# EAGLE design button-led-matrix-4x4 (EAGLE 7.7.0)
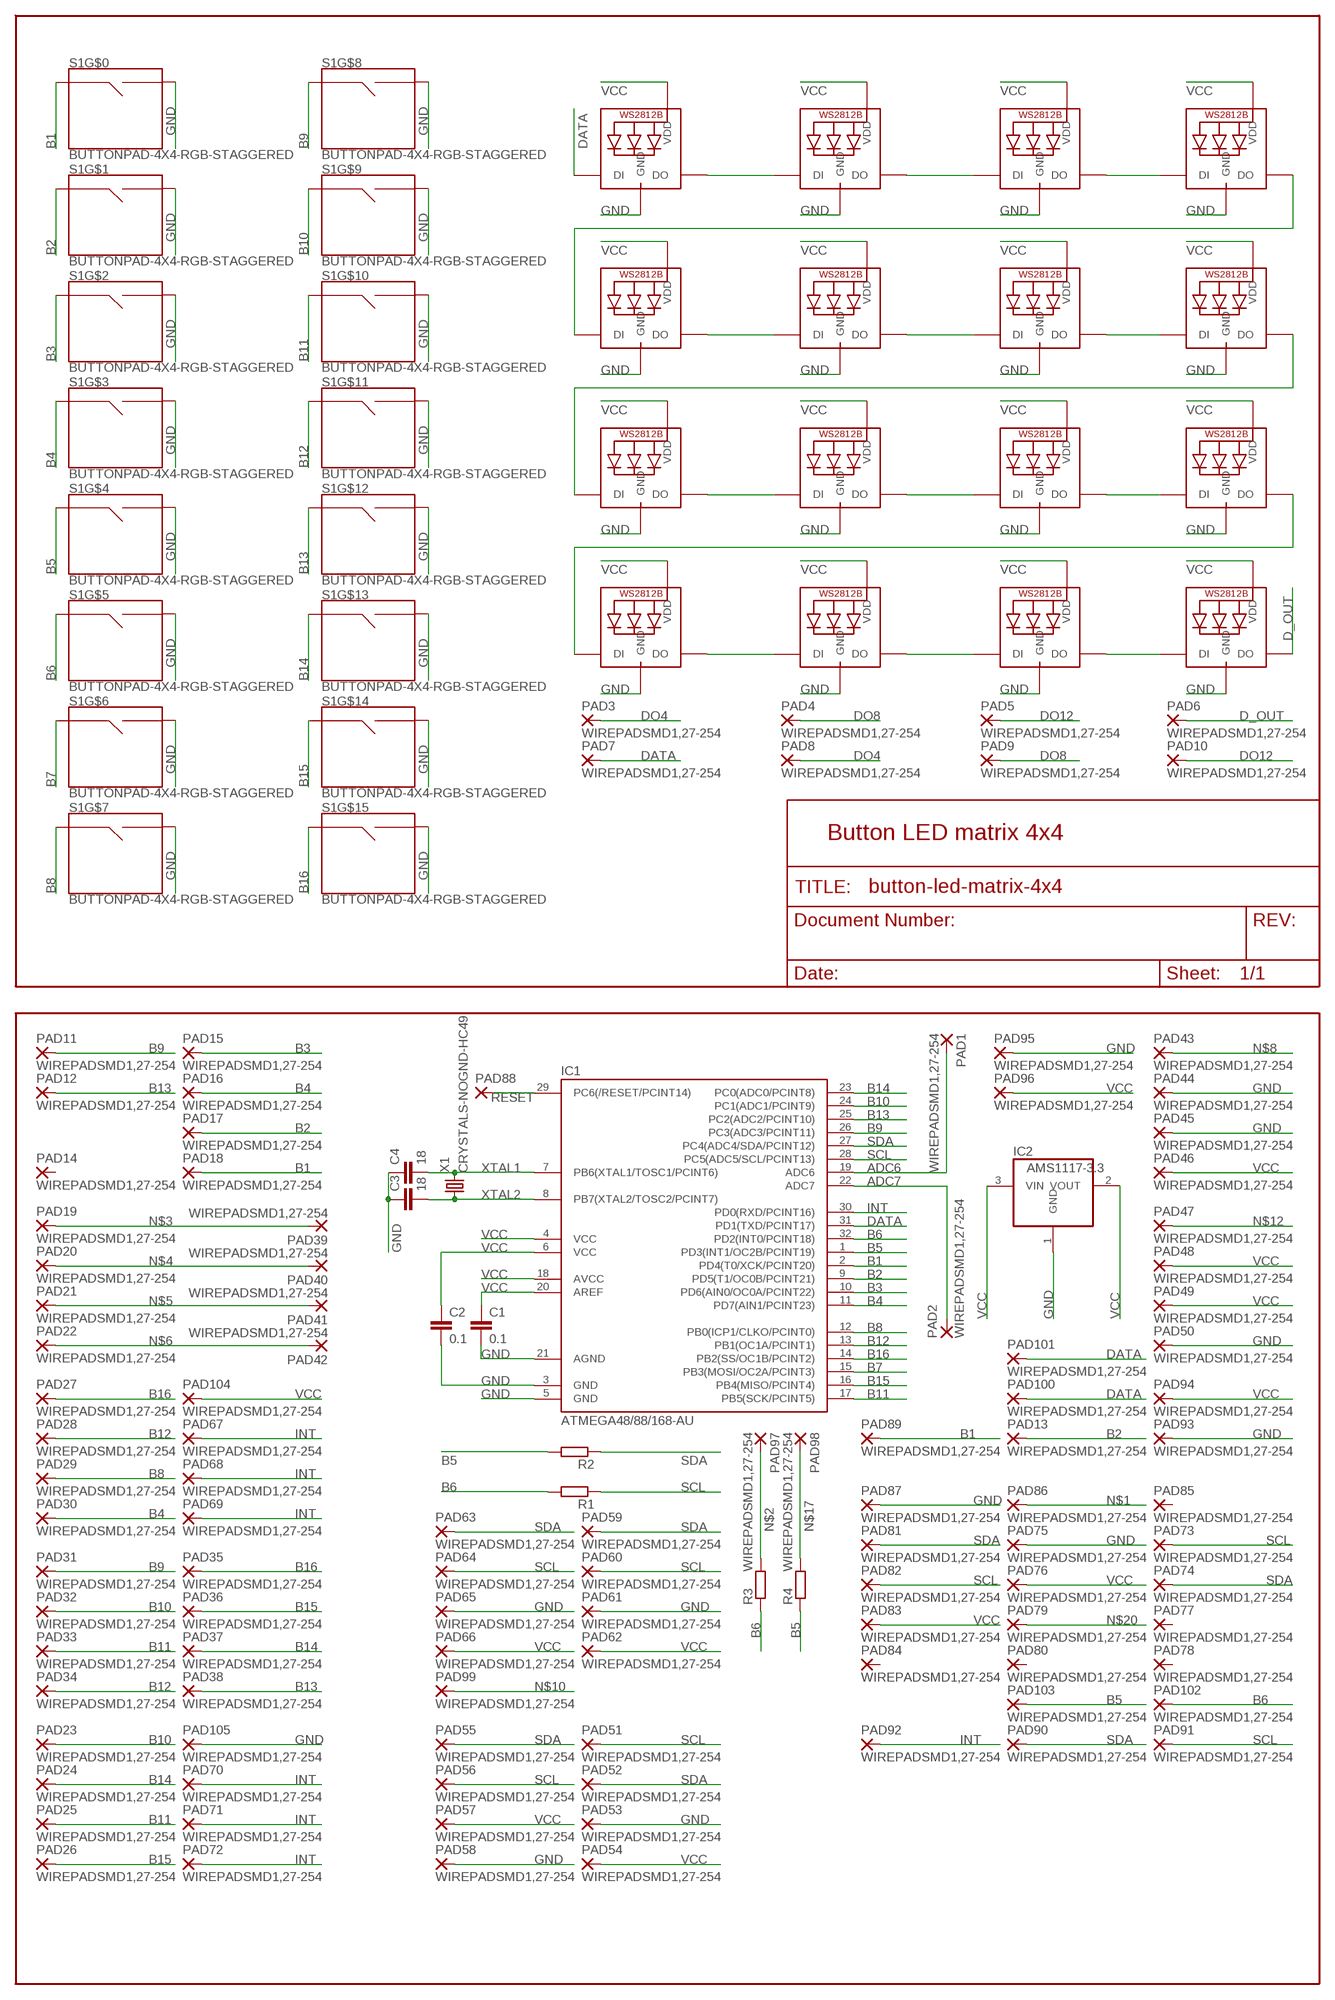
[diagram p0: schematic, sheet 1]

## Parts
C1  0.1  C-EUC0805  [C0805]
C2  0.1  C-EUC0805  [C0805]
C3  18  C-EUC0805  [C0805]
C4  18  C-EUC0805  [C0805]
IC1  ATMEGA48/88/168-AU  [TQFP32-08]
IC2  AMS1117-3.3  REG1117  [SOT223]
LED1  WS2812B_5050N  [WS2812B-NARROW]
LED2  WS2812B_5050N  [WS2812B-NARROW]
LED3  WS2812B_5050N  [WS2812B-NARROW]
LED4  WS2812B_5050N  [WS2812B-NARROW]
LED5  WS2812B_5050N  [WS2812B-NARROW]
LED6  WS2812B_5050N  [WS2812B-NARROW]
LED7  WS2812B_5050N  [WS2812B-NARROW]
LED8  WS2812B_5050N  [WS2812B-NARROW]
LED9  WS2812B_5050N  [WS2812B-NARROW]
LED10  WS2812B_5050N  [WS2812B-NARROW]
LED11  WS2812B_5050N  [WS2812B-NARROW]
LED12  WS2812B_5050N  [WS2812B-NARROW]
LED13  WS2812B_5050N  [WS2812B-NARROW]
LED14  WS2812B_5050N  [WS2812B-NARROW]
LED15  WS2812B_5050N  [WS2812B-NARROW]
LED16  WS2812B_5050N  [WS2812B-NARROW]
PAD1  WIREPADSMD1,27-254  [SMD1,27-2,54]
PAD2  WIREPADSMD1,27-254  [SMD1,27-2,54]
PAD3  WIREPADSMD1,27-254  [SMD1,27-2,54]
PAD4  WIREPADSMD1,27-254  [SMD1,27-2,54]
PAD5  WIREPADSMD1,27-254  [SMD1,27-2,54]
PAD6  WIREPADSMD1,27-254  [SMD1,27-2,54]
PAD7  WIREPADSMD1,27-254  [SMD1,27-2,54]
PAD8  WIREPADSMD1,27-254  [SMD1,27-2,54]
PAD9  WIREPADSMD1,27-254  [SMD1,27-2,54]
PAD10  WIREPADSMD1,27-254  [SMD1,27-2,54]
PAD11  WIREPADSMD1,27-254  [SMD1,27-2,54]
PAD12  WIREPADSMD1,27-254  [SMD1,27-2,54]
PAD13  WIREPADSMD1,27-254  [SMD1,27-2,54]
PAD14  WIREPADSMD1,27-254  [SMD1,27-2,54]
PAD15  WIREPADSMD1,27-254  [SMD1,27-2,54]
PAD16  WIREPADSMD1,27-254  [SMD1,27-2,54]
PAD17  WIREPADSMD1,27-254  [SMD1,27-2,54]
PAD18  WIREPADSMD1,27-254  [SMD1,27-2,54]
PAD19  WIREPADSMD1,27-254  [SMD1,27-2,54]
PAD20  WIREPADSMD1,27-254  [SMD1,27-2,54]
PAD21  WIREPADSMD1,27-254  [SMD1,27-2,54]
PAD22  WIREPADSMD1,27-254  [SMD1,27-2,54]
PAD23  WIREPADSMD1,27-254  [SMD1,27-2,54]
PAD24  WIREPADSMD1,27-254  [SMD1,27-2,54]
PAD25  WIREPADSMD1,27-254  [SMD1,27-2,54]
PAD26  WIREPADSMD1,27-254  [SMD1,27-2,54]
PAD27  WIREPADSMD1,27-254  [SMD1,27-2,54]
PAD28  WIREPADSMD1,27-254  [SMD1,27-2,54]
PAD29  WIREPADSMD1,27-254  [SMD1,27-2,54]
PAD30  WIREPADSMD1,27-254  [SMD1,27-2,54]
PAD31  WIREPADSMD1,27-254  [SMD1,27-2,54]
PAD32  WIREPADSMD1,27-254  [SMD1,27-2,54]
PAD33  WIREPADSMD1,27-254  [SMD1,27-2,54]
PAD34  WIREPADSMD1,27-254  [SMD1,27-2,54]
PAD35  WIREPADSMD1,27-254  [SMD1,27-2,54]
PAD36  WIREPADSMD1,27-254  [SMD1,27-2,54]
PAD37  WIREPADSMD1,27-254  [SMD1,27-2,54]
PAD38  WIREPADSMD1,27-254  [SMD1,27-2,54]
PAD39  WIREPADSMD1,27-254  [SMD1,27-2,54]
PAD40  WIREPADSMD1,27-254  [SMD1,27-2,54]
PAD41  WIREPADSMD1,27-254  [SMD1,27-2,54]
PAD42  WIREPADSMD1,27-254  [SMD1,27-2,54]
PAD43  WIREPADSMD1,27-254  [SMD1,27-2,54]
PAD44  WIREPADSMD1,27-254  [SMD1,27-2,54]
PAD45  WIREPADSMD1,27-254  [SMD1,27-2,54]
PAD46  WIREPADSMD1,27-254  [SMD1,27-2,54]
PAD47  WIREPADSMD1,27-254  [SMD1,27-2,54]
PAD48  WIREPADSMD1,27-254  [SMD1,27-2,54]
PAD49  WIREPADSMD1,27-254  [SMD1,27-2,54]
PAD50  WIREPADSMD1,27-254  [SMD1,27-2,54]
PAD51  WIREPADSMD1,27-254  [SMD1,27-2,54]
PAD52  WIREPADSMD1,27-254  [SMD1,27-2,54]
PAD53  WIREPADSMD1,27-254  [SMD1,27-2,54]
PAD54  WIREPADSMD1,27-254  [SMD1,27-2,54]
PAD55  WIREPADSMD1,27-254  [SMD1,27-2,54]
PAD56  WIREPADSMD1,27-254  [SMD1,27-2,54]
PAD57  WIREPADSMD1,27-254  [SMD1,27-2,54]
PAD58  WIREPADSMD1,27-254  [SMD1,27-2,54]
PAD59  WIREPADSMD1,27-254  [SMD1,27-2,54]
PAD60  WIREPADSMD1,27-254  [SMD1,27-2,54]
PAD61  WIREPADSMD1,27-254  [SMD1,27-2,54]
PAD62  WIREPADSMD1,27-254  [SMD1,27-2,54]
PAD63  WIREPADSMD1,27-254  [SMD1,27-2,54]
PAD64  WIREPADSMD1,27-254  [SMD1,27-2,54]
PAD65  WIREPADSMD1,27-254  [SMD1,27-2,54]
PAD66  WIREPADSMD1,27-254  [SMD1,27-2,54]
PAD67  WIREPADSMD1,27-254  [SMD1,27-2,54]
PAD68  WIREPADSMD1,27-254  [SMD1,27-2,54]
PAD69  WIREPADSMD1,27-254  [SMD1,27-2,54]
PAD70  WIREPADSMD1,27-254  [SMD1,27-2,54]
PAD71  WIREPADSMD1,27-254  [SMD1,27-2,54]
PAD72  WIREPADSMD1,27-254  [SMD1,27-2,54]
PAD73  WIREPADSMD1,27-254  [SMD1,27-2,54]
PAD74  WIREPADSMD1,27-254  [SMD1,27-2,54]
PAD75  WIREPADSMD1,27-254  [SMD1,27-2,54]
PAD76  WIREPADSMD1,27-254  [SMD1,27-2,54]
PAD77  WIREPADSMD1,27-254  [SMD1,27-2,54]
PAD78  WIREPADSMD1,27-254  [SMD1,27-2,54]
PAD79  WIREPADSMD1,27-254  [SMD1,27-2,54]
PAD80  WIREPADSMD1,27-254  [SMD1,27-2,54]
PAD81  WIREPADSMD1,27-254  [SMD1,27-2,54]
PAD82  WIREPADSMD1,27-254  [SMD1,27-2,54]
PAD83  WIREPADSMD1,27-254  [SMD1,27-2,54]
PAD84  WIREPADSMD1,27-254  [SMD1,27-2,54]
PAD85  WIREPADSMD1,27-254  [SMD1,27-2,54]
PAD86  WIREPADSMD1,27-254  [SMD1,27-2,54]
PAD87  WIREPADSMD1,27-254  [SMD1,27-2,54]
PAD88  1,6/0,8  [1,6/0,8]
PAD89  WIREPADSMD1,27-254  [SMD1,27-2,54]
PAD90  WIREPADSMD1,27-254  [SMD1,27-2,54]
PAD91  WIREPADSMD1,27-254  [SMD1,27-2,54]
PAD92  WIREPADSMD1,27-254  [SMD1,27-2,54]
PAD93  WIREPADSMD1,27-254  [SMD1,27-2,54]
PAD94  WIREPADSMD1,27-254  [SMD1,27-2,54]
PAD95  WIREPADSMD1,27-254  [SMD1,27-2,54]
PAD96  WIREPADSMD1,27-254  [SMD1,27-2,54]
PAD97  WIREPADSMD1,27-254  [SMD1,27-2,54]
PAD98  WIREPADSMD1,27-254  [SMD1,27-2,54]
PAD99  WIREPADSMD1,27-254  [SMD1,27-2,54]
PAD100  WIREPADSMD1,27-254  [SMD1,27-2,54]
PAD101  WIREPADSMD1,27-254  [SMD1,27-2,54]
PAD102  WIREPADSMD1,27-254  [SMD1,27-2,54]
PAD103  WIREPADSMD1,27-254  [SMD1,27-2,54]
PAD104  WIREPADSMD1,27-254  [SMD1,27-2,54]
PAD105  WIREPADSMD1,27-254  [SMD1,27-2,54]
R1  R-EU_R1206  [R1206]
R2  R-EU_R1206  [R1206]
R3  R-EU_R0805  [R0805]
R4  R-EU_R0805  [R0805]
S1  BUTTONPAD-4X4-RGB-STAGGERED  [BUTTONPAD-4X4-STAGGERED]
X1  CRYSTALS-NOGND-HC49  [HC49]

## Nets
ADC6: IC1.19(ADC6) PAD1.1(P)
ADC7: IC1.22(ADC7) PAD2.1(P)
B1: IC1.2(PD4(T0/XCK/PCINT20)) PAD18.1(P) PAD89.1(P) S1.SIG0(SIG1)
B2: IC1.9(PD5(T1/OC0B/PCINT21)) PAD13.1(P) PAD17.1(P) S1.SIG2(SIG1)
B3: IC1.10(PD6(AIN0/OC0A/PCINT22)) PAD15.1(P) S1.SIG4(SIG1)
B4: IC1.11(PD7(AIN1/PCINT23)) PAD16.1(P) PAD30.1(P) S1.SIG6(SIG1)
B5: IC1.1(PD3(INT1/OC2B/PCINT19)) PAD103.1(P) R2.2 R4.1 S1.SIG8(SIG1)
B6: IC1.32(PD2(INT0/PCINT18)) PAD102.1(P) R1.2 R3.1 S1.SIG10(SIG1)
B7: IC1.15(PB3(MOSI/OC2A/PCINT3)) S1.SIG12(SIG1)
B8: IC1.12(PB0(ICP1/CLKO/PCINT0)) PAD29.1(P) S1.SIG14(SIG1)
B9: IC1.26(PC3(ADC3/PCINT11)) PAD11.1(P) PAD31.1(P) S1.SIG16(SIG1)
B10: IC1.24(PC1(ADC1/PCINT9)) PAD23.1(P) PAD32.1(P) S1.SIG18(SIG1)
B11: IC1.17(PB5(SCK/PCINT5)) PAD25.1(P) PAD33.1(P) S1.SIG20(SIG1)
B12: IC1.13(PB1(OC1A/PCINT1)) PAD28.1(P) PAD34.1(P) S1.SIG22(SIG1)
B13: IC1.25(PC2(ADC2/PCINT10)) PAD12.1(P) PAD38.1(P) S1.SIG24(SIG1)
B14: IC1.23(PC0(ADC0/PCINT8)) PAD24.1(P) PAD37.1(P) S1.SIG26(SIG1)
B15: IC1.16(PB4(MISO/PCINT4)) PAD26.1(P) PAD36.1(P) S1.SIG28(SIG1)
B16: IC1.14(PB2(SS/OC1B/PCINT2)) PAD27.1(P) PAD35.1(P) S1.SIG30(SIG1)
D_OUT: LED16.2-DOUT(DO) PAD6.1(P)
DATA: IC1.31(PD1(TXD/PCINT17)) LED1.4-DIN(DI) PAD7.1(P) PAD100.1(P) PAD101.1(P)
DO1: LED1.2-DOUT(DO) LED2.4-DIN(DI)
DO2: LED2.2-DOUT(DO) LED3.4-DIN(DI)
DO3: LED3.2-DOUT(DO) LED4.4-DIN(DI)
DO4: LED4.2-DOUT(DO) LED5.4-DIN(DI) PAD3.1(P) PAD8.1(P)
DO6: LED6.2-DOUT(DO) LED7.4-DIN(DI)
DO7: LED7.2-DOUT(DO) LED8.4-DIN(DI)
DO8: LED8.2-DOUT(DO) LED9.4-DIN(DI) PAD4.1(P) PAD9.1(P)
DO9: LED9.2-DOUT(DO) LED10.4-DIN(DI)
DO10: LED10.2-DOUT(DO) LED11.4-DIN(DI)
DO11: LED11.2-DOUT(DO) LED12.4-DIN(DI)
DO12: LED12.2-DOUT(DO) LED13.4-DIN(DI) PAD5.1(P) PAD10.1(P)
DO13: LED13.2-DOUT(DO) LED14.4-DIN(DI)
DO14: LED14.2-DOUT(DO) LED15.4-DIN(DI)
DO15: LED15.2-DOUT(DO) LED16.4-DIN(DI)
FO5: LED5.2-DOUT(DO) LED6.4-DIN(DI)
GND: C1.2 C2.2 C3.1 C4.1 IC1.3(GND) IC1.5(GND) IC1.21(AGND) IC2.1(GND) LED1.3-GND(GND) LED2.3-GND(GND) LED3.3-GND(GND) LED4.3-GND(GND) LED5.3-GND(GND) LED6.3-GND(GND) LED7.3-GND(GND) LED8.3-GND(GND) LED9.3-GND(GND) LED10.3-GND(GND) LED11.3-GND(GND) LED12.3-GND(GND) LED13.3-GND(GND) LED14.3-GND(GND) LED15.3-GND(GND) LED16.3-GND(GND) PAD44.1(P) PAD45.1(P) PAD50.1(P) PAD53.1(P) PAD58.1(P) PAD61.1(P) PAD65.1(P) PAD75.1(P) PAD87.1(P) PAD93.1(P) PAD95.1(P) PAD105.1(P) S1.SIG1(SIG2) S1.SIG3(SIG2) S1.SIG5(SIG2) S1.SIG7(SIG2) S1.SIG9(SIG2) S1.SIG11(SIG2) S1.SIG13(SIG2) S1.SIG15(SIG2) S1.SIG17(SIG2) S1.SIG19(SIG2) S1.SIG21(SIG2) S1.SIG23(SIG2) S1.SIG25(SIG2) S1.SIG27(SIG2) S1.SIG29(SIG2) S1.SIG31(SIG2)
INT: IC1.30(PD0(RXD/PCINT16)) PAD67.1(P) PAD68.1(P) PAD69.1(P) PAD70.1(P) PAD71.1(P) PAD72.1(P) PAD92.1(P)
N$1: PAD86.1(P)
N$2: PAD97.1(P) R3.2
N$3: PAD19.1(P) PAD39.1(P)
N$4: PAD20.1(P) PAD40.1(P)
N$5: PAD21.1(P) PAD41.1(P)
N$6: PAD22.1(P) PAD42.1(P)
N$8: PAD43.1(P)
N$10: PAD99.1(P)
N$12: PAD47.1(P)
N$17: PAD98.1(P) R4.2
N$20: PAD79.1(P)
RESET: IC1.29(PC6(/RESET/PCINT14)) PAD88.1(P)
SCL: IC1.28(PC5(ADC5/SCL/PCINT13)) PAD51.1(P) PAD56.1(P) PAD60.1(P) PAD64.1(P) PAD73.1(P) PAD82.1(P) PAD91.1(P) R1.1
SDA: IC1.27(PC4(ADC4/SDA/PCINT12)) PAD52.1(P) PAD55.1(P) PAD59.1(P) PAD63.1(P) PAD74.1(P) PAD81.1(P) PAD90.1(P) R2.1
VCC: C1.1 C2.1 IC1.4(VCC) IC1.6(VCC) IC1.18(AVCC) IC1.20(AREF) IC2.2(VOUT) IC2.3(VIN) LED1.1-VDD(VDD) LED2.1-VDD(VDD) LED3.1-VDD(VDD) LED4.1-VDD(VDD) LED5.1-VDD(VDD) LED6.1-VDD(VDD) LED7.1-VDD(VDD) LED8.1-VDD(VDD) LED9.1-VDD(VDD) LED10.1-VDD(VDD) LED11.1-VDD(VDD) LED12.1-VDD(VDD) LED13.1-VDD(VDD) LED14.1-VDD(VDD) LED15.1-VDD(VDD) LED16.1-VDD(VDD) PAD46.1(P) PAD48.1(P) PAD49.1(P) PAD54.1(P) PAD57.1(P) PAD62.1(P) PAD66.1(P) PAD76.1(P) PAD83.1(P) PAD94.1(P) PAD96.1(P) PAD104.1(P)
XTAL1: C4.2 IC1.7(PB6(XTAL1/TOSC1/PCINT6)) X1.2
XTAL2: C3.2 IC1.8(PB7(XTAL2/TOSC2/PCINT7)) X1.1
Unconnected: PAD14.1(P) PAD77.1(P) PAD78.1(P) PAD80.1(P) PAD84.1(P) PAD85.1(P)

## Notes on the sheet
- Button LED matrix 4x4

## Library data of the parts
C1-C4 = rcl:C-EU: CAPACITOR, European symbol
IC1 = atmega8:ATMEGA48/88/168
IC2 = burr-brown:REG1117: 800mA and 1A Low Dropout (LDO) Positive Regulator 1.8V, 2.5V, 2.85V, 3.3V, 5V, and Adj; MPN: REG1117; OC_FARNELL: 1097566; OC_NEWARK: 14P6981
LED1-LED16 = adafruit:WS2812B
PAD1-PAD87 PAD89-PAD105 = wirepad:WIREPAD: Wire PAD connect wire on PCB
PAD88 = wirepad:1,6/0,8: THROUGH-HOLE PAD
R1-R4 = rcl:R-EU_: RESISTOR, European symbol
S1 = SparkFun-Switches:BUTTONPAD-4X4-RGB: 4x4 Button Pad w/ RGB LEDs Layout and schematic for 4x4 button pad with tri-color LEDs under each button. For use with the 4x Button Pad 2x2 - LED Compatible <https://www.sparkfun.com/products/7836> and 4x Button Pad 2x2 Top Bezel <https://www.sparkfun.com/products/8746>. Any RGB 5mm LED <https://www.sparkfun.com/categories/172> should be compatible. SparkFun Products SparkFun Simon Says - Through-Hole Soldering Kit <https://www.sparkfun.com/products/10547> (KIT-10547) Button Pad 2x2 - Breakout PCB <https://www.sparkfun.com/products/9277> (COM-09277); PROD_ID: COMP-08481; SF_SKU: COM-07836
X1 = IQD-Frequency-Products:CRYSTALS-NOGND: CRYSTALS CAN NOT GROUNDED

## Net classes
0 Default: width 0.254 mm
1 Power: width 0.305 mm
2 LEDPower: width 0.305 mm
3 ButtonSignal: width 0.254 mm

## Board
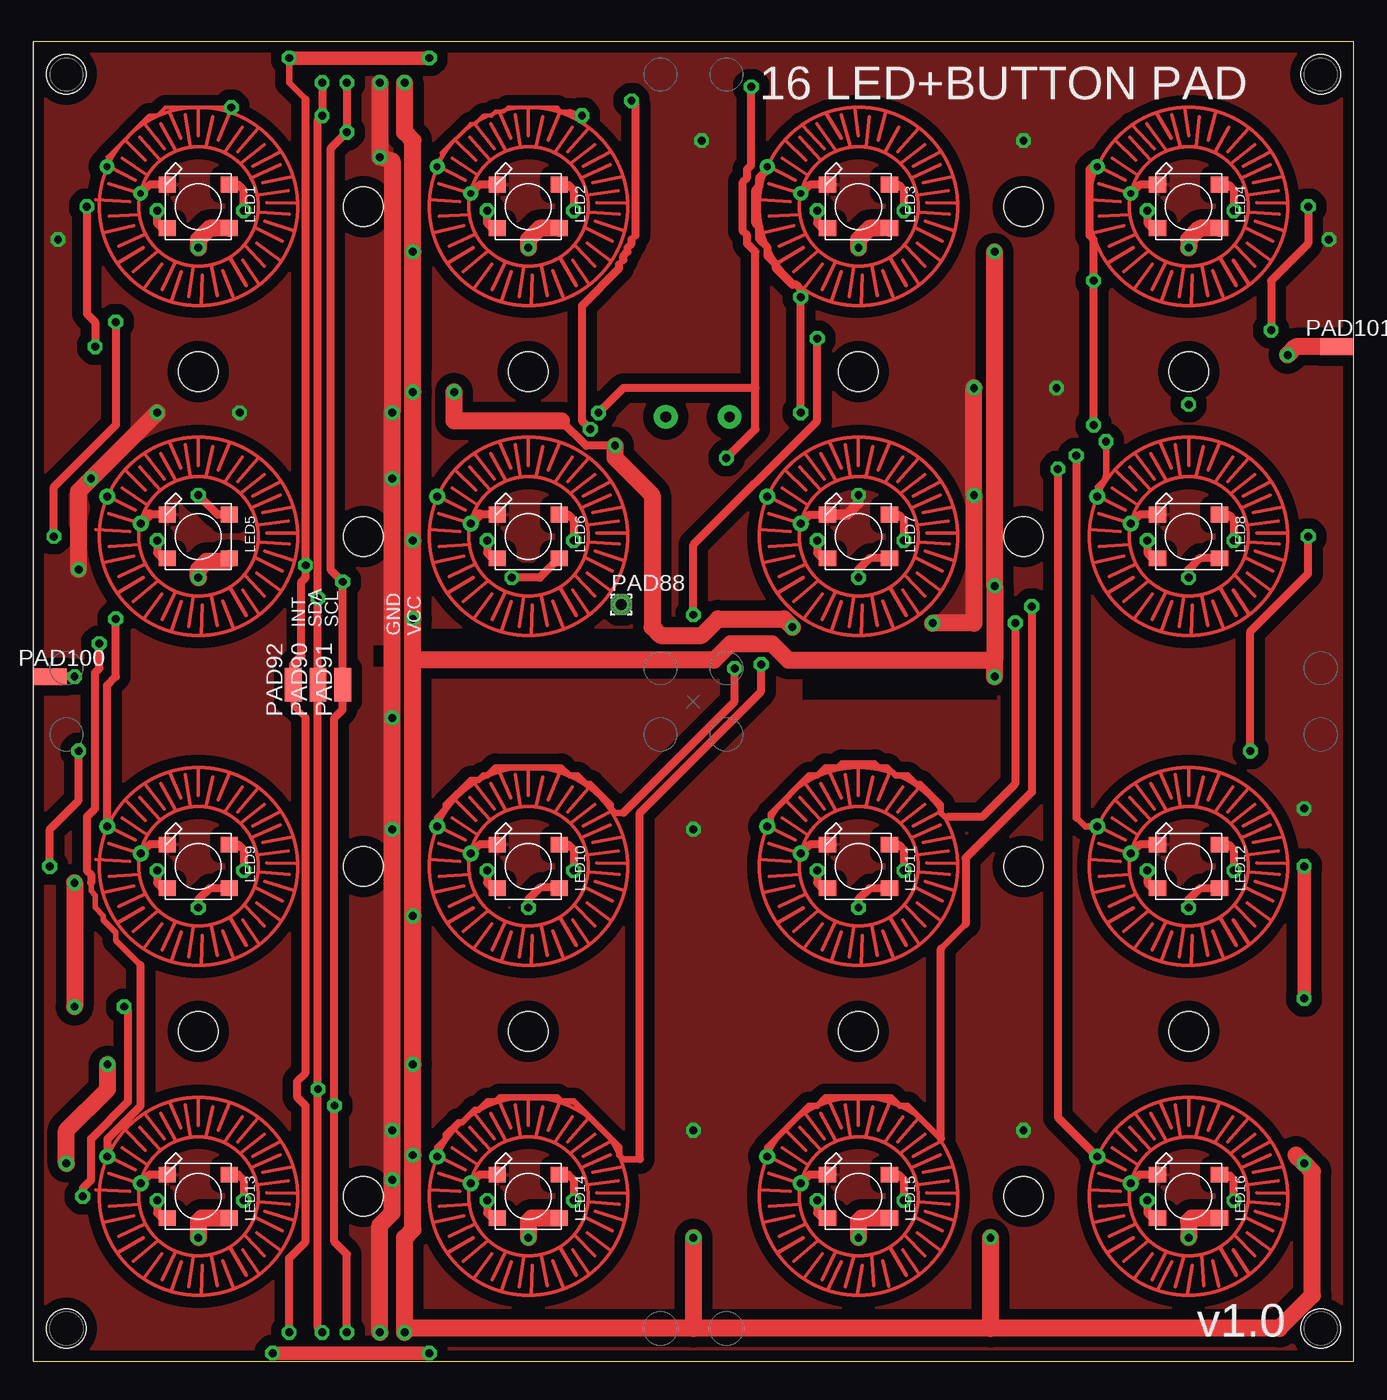
[diagram p1: board, top side]
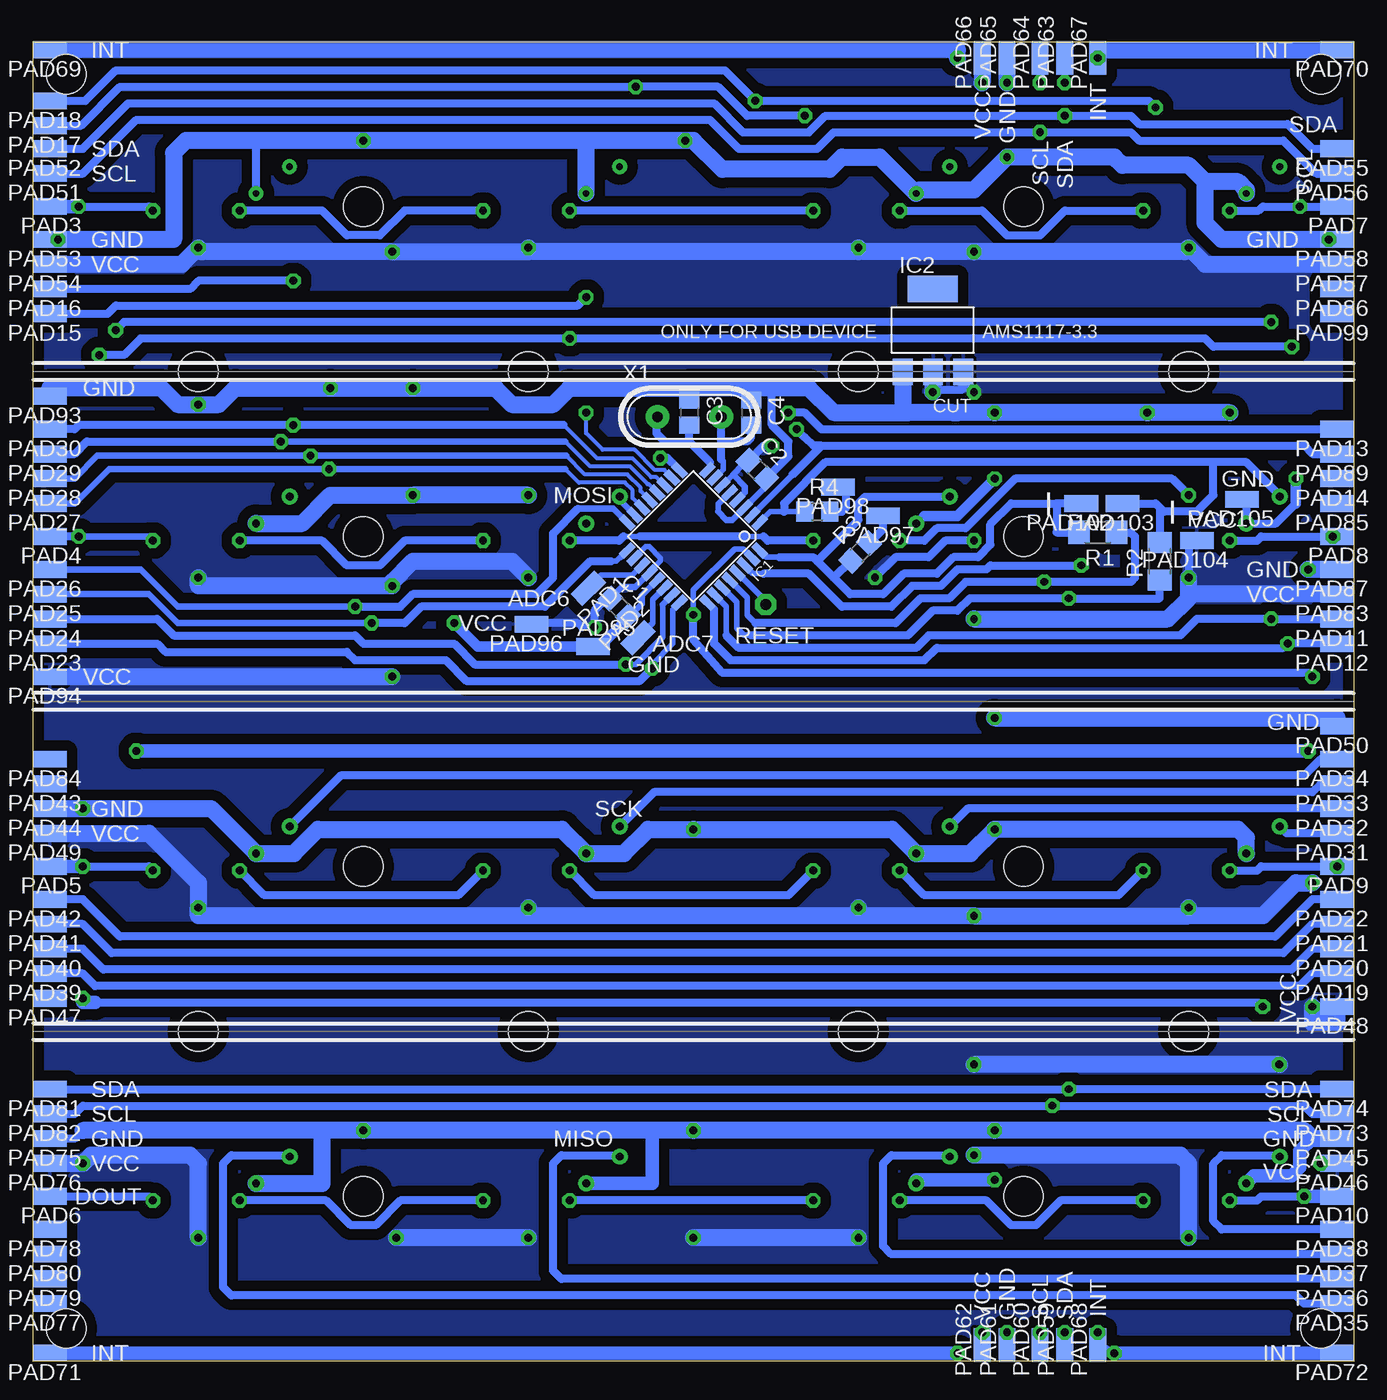
[diagram p2: board, bottom side, seen from below]

Size 100 x 100 mm. Coordinates in mm from the lower left corner, seen from the top.
Outline: 0,0 100,0 100,100 0,100 0,0
Copper layers (1*16): Top 0.035mm / dielectric 1.5mm / Bottom 0.035mm
Design rules "SparkFun": minimum track width 8mil, minimum drill 20mil, track to track 8mil, track to pad 8mil, pad to pad 8mil, via to via 8mil, smd to smd 8mil, copper to edge 10mil, drill to drill 8mil, minimum pad ring 12mil, minimum via ring 10mil, stop-mask expansion 4mil, vias tented up to drill 25mil, thermal gap 10mil

### Footprints (pad centres in the part's own frame; a part is rotated, then mirrored left to right if it is on the bottom)
C0805 = smd 1.3 x 1.5: 1 -0.95,0; 2 0.95,0
TQFP32-08 = smd 1.27 x 0.559: 1 -4.293,2.8; 2 -4.293,2; 3 -4.293,1.2; 4 -4.293,0.4; 5 -4.293,-0.4; 6 -4.293,-1.2; 7 -4.293,-2; 8 -4.293,-2.8; 17 4.293,-2.8; 18 4.293,-2; 19 4.293,-1.2; 20 4.293,-0.4; 21 4.293,0.4; 22 4.293,1.2; 23 4.293,2; 24 4.293,2.8 | smd 0.559 x 1.27: 9 -2.8,-4.293; 10 -2,-4.293; 11 -1.2,-4.293; 12 -0.4,-4.293; 13 0.4,-4.293; 14 1.2,-4.293; 15 2,-4.293; 16 2.8,-4.293; 25 2.8,4.293; 26 2,4.293; 27 1.2,4.293; 28 0.4,4.293; 29 -0.4,4.293; 30 -1.2,4.293; 31 -2,4.293; 32 -2.8,4.293
SOT223 = smd 1.499 x 2.007: 1 -2.261,-3.15; 2 0.025,-3.15; 3 2.311,-3.15 | smd 3.81 x 2.007: 4 0,3.15
WS2812B-NARROW = smd 1.3 x 1.2: 1-VDD 2.35,-1.65; 2-DOUT 2.35,1.65; 3-GND -2.35,1.65; 4-DIN -2.35,-1.65
SMD1,27-2,54 = smd 1.27 x 2.54: 1 0,0
1,6/0,8 = drill 0.813 pad 1.6 octagon: 1 0,0
R1206 = smd 1.6 x 1.803: 1 -1.422,0; 2 1.422,0
R0805 = smd 1.3 x 1.5: 1 -0.95,0; 2 0.95,0
BUTTONPAD-4X4-STAGGERED = drill 0.508: SIG0 5.588,90.513; SIG1 8.128,88.481; SIG2 30.588,90.513; SIG3 33.128,88.481; SIG4 55.588,90.513; SIG5 58.128,88.481; SIG6 80.588,90.513; SIG7 83.128,88.481 | drill 0.6: SIG8 5.588,65.513; SIG9 8.128,63.481; SIG10 30.588,65.513; SIG11 33.128,63.481; SIG12 55.588,65.513; SIG13 58.128,63.481; SIG14 80.588,65.513; SIG15 83.128,63.481; SIG16 5.588,40.513; SIG17 8.128,38.481; SIG18 30.588,40.513; SIG19 33.128,38.481; SIG20 55.588,40.513; SIG21 58.128,38.481; SIG22 80.588,40.513; SIG23 83.128,38.481; SIG24 5.588,15.513; SIG25 8.128,13.481; SIG26 30.588,15.513; SIG27 33.128,13.481; SIG28 55.588,15.513; SIG29 58.128,13.481; SIG30 80.588,15.513; SIG31 83.128,13.481 | hole 3: 12.5,25; 25,37.5; 37.5,25; 25,12.5; 62.5,25; 75,37.5; 87.5,25; 75,12.5; 12.5,75; 25,87.5; 37.5,75; 25,62.5; 62.5,75; 75,87.5; 87.5,75; 75,62.5; 2.484,97.516; 97.516,97.516; 97.516,2.484; 2.484,2.484
HC49 = drill 0.813 pad 1.8: 1 -2.413,0; 2 2.413,0

### Placement (x,y rotation side)
C1  55.62,57.13 315 bottom
C2  45.16,67.55 315 bottom
C3  50.31,71.88 270 bottom
C4  45.62,71.88 270 bottom
IC1  50,62.5 225 bottom
IC2  31.88,78.12 0 bottom
LED1  12.5,87.5 0 top
LED2  37.5,87.5 0 top
LED3  62.5,87.5 0 top
LED4  87.5,87.5 0 top
LED5  12.5,62.5 0 top
LED6  37.5,62.5 0 top
LED7  62.5,62.5 0 top
LED8  87.5,62.5 0 top
LED9  12.5,37.5 0 top
LED10  37.5,37.5 0 top
LED11  62.5,37.5 0 top
LED12  87.5,37.5 0 top
LED13  12.5,12.5 0 top
LED14  37.5,12.5 0 top
LED15  62.5,12.5 0 top
LED16  87.5,12.5 0 top
PAD1  57.96,58.58 135 bottom
PAD2  54.19,54.84 315 bottom
PAD3  98.75,87.5 90 bottom
PAD4  98.75,62.5 90 bottom
PAD5  98.75,37.5 90 bottom
PAD6  98.75,12.5 90 bottom
PAD7  1.25,87.5 90 bottom
PAD8  1.25,62.5 90 bottom
PAD9  1.25,37.5 90 bottom
PAD10  1.25,12.5 90 bottom
PAD11  1.25,56.25 90 bottom
PAD12  1.25,54.38 90 bottom
PAD13  1.25,70.62 90 bottom
PAD14  1.25,66.88 90 bottom
PAD15  98.75,79.38 90 bottom
PAD16  98.75,81.25 90 bottom
PAD17  98.75,93.62 90 bottom
PAD18  98.75,95.5 90 bottom
PAD19  1.25,29.38 90 bottom
PAD20  1.25,31.25 90 bottom
PAD21  1.25,33.12 90 bottom
PAD22  1.25,35 90 bottom
PAD23  98.75,54.38 90 bottom
PAD24  98.75,56.25 90 bottom
PAD25  98.75,58.12 90 bottom
PAD26  98.75,60 90 bottom
PAD27  98.75,65 90 bottom
PAD28  98.75,66.88 90 bottom
PAD29  98.75,68.75 90 bottom
PAD30  98.75,70.62 90 bottom
PAD31  1.25,40 90 bottom
PAD32  1.25,41.88 90 bottom
PAD33  1.25,43.75 90 bottom
PAD34  1.25,45.62 90 bottom
PAD35  1.25,4.38 90 bottom
PAD36  1.25,6.25 90 bottom
PAD37  1.25,8.12 90 bottom
PAD38  1.25,10 90 bottom
PAD39  98.75,29.38 90 bottom
PAD40  98.75,31.25 90 bottom
PAD41  98.75,33.12 90 bottom
PAD42  98.75,35 90 bottom
PAD43  98.75,43.75 90 bottom
PAD44  98.75,41.88 90 bottom
PAD45  1.25,16.88 90 bottom
PAD46  1.25,15 90 bottom
PAD47  98.75,27.5 90 bottom
PAD48  1.25,26.88 90 bottom
PAD49  98.75,40 90 bottom
PAD50  1.25,48.12 90 bottom
PAD51  98.75,90 90 bottom
PAD52  98.75,91.88 90 bottom
PAD53  98.75,85 90 bottom
PAD54  98.75,83.12 90 bottom
PAD55  1.25,91.88 90 bottom
PAD56  1.25,90 90 bottom
PAD57  1.25,83.12 90 bottom
PAD58  1.25,85 90 bottom
PAD59  21.88,1.25 0 bottom
PAD60  23.75,1.25 0 bottom
PAD61  26.25,1.25 0 bottom
PAD62  28.12,1.25 0 bottom
PAD63  21.88,98.75 0 bottom
PAD64  23.75,98.75 0 bottom
PAD65  26.25,98.75 0 bottom
PAD66  28.12,98.75 0 bottom
PAD67  19.38,98.75 0 bottom
PAD68  19.38,1.25 0 bottom
PAD69  98.75,99.38 90 bottom
PAD70  1.25,99.38 90 bottom
PAD71  98.75,0.62 90 bottom
PAD72  1.25,0.62 90 bottom
PAD73  1.25,18.75 90 bottom
PAD74  1.25,20.62 90 bottom
PAD75  98.75,16.88 90 bottom
PAD76  98.75,15 90 bottom
PAD77  98.75,4.38 90 bottom
PAD78  98.75,10 90 bottom
PAD79  98.75,6.25 90 bottom
PAD80  98.75,8.12 90 bottom
PAD81  98.75,20.62 90 bottom
PAD82  98.75,18.75 90 bottom
PAD83  1.25,58.12 90 bottom
PAD84  98.75,45.62 90 bottom
PAD85  1.25,65 90 bottom
PAD86  1.25,81.25 90 bottom
PAD87  1.25,60 90 bottom
PAD88  44.53,57.34 0 top
PAD89  1.25,68.75 90 bottom
PAD90  21.56,51.25 0 top
PAD91  23.44,51.25 0 top
PAD92  19.69,51.25 0 top
PAD93  98.75,73.12 90 bottom
PAD94  98.75,51.88 90 bottom
PAD95  57.59,54.15 270 bottom
PAD96  62.28,55.85 90 bottom
PAD97  35.62,64.06 90 bottom
PAD98  39.06,66.25 90 bottom
PAD99  1.25,79.38 90 bottom
PAD100  1.25,51.88 270 top
PAD101  98.75,76.88 270 top
PAD102  20.62,65 90 bottom
PAD103  17.5,65 90 bottom
PAD104  11.88,62.19 90 bottom
PAD105  8.44,65.31 90 bottom
R1  19.38,62.81 180 bottom
R2  14.69,60.62 90 bottom
R3  37.37,61.33 45 bottom
R4  40.62,64.38 0 bottom
S1  0,0 0 top
X1  50.31,71.56 0 bottom

### Tracks (layer width: path | path; a pad name or v marks a point on that pad's centre or on a via)
ADC6
  Bottom 0.406: IC1.19 54.63,59.56 56.97,59.56 PAD1.1
ADC7
  Bottom 0.406: IC1.22 53.09,57.72 53.09,55.94 PAD2.1
B1  (via drill 0.6)
  Top 0.305: v15,95 10,95 9.38,94.38 8.75,94.38 5.62,91.25 5.62,90.55 S1.SIG0
  Top 0.406: 44.38,83.12 44.69,83.44 | 45,84.06 45,84.38 | 45.31,85 45.62,85.31 | 45.62,95.19 v45.31,95.5
  Top 0.61: 44.38,83.12 44.38,82.81 41.56,80 41.56,71.25 v42.19,70.62 | 44.69,83.44 44.69,83.75 45,84.06 | 45,84.38 45.31,84.69 45.31,85 | 45.62,85.31 45.62,95.19
  Bottom 0.406: IC1.2 42.48,67.19
  Bottom 0.61: v15,95 15.5,95.5 v45.31,95.5 47.62,97.81 93.75,97.81 96.06,95.5 PAD18.1 | 42.48,67.19 40.3,69.38 | 40.3,69.38 40.94,69.39 41.56,70 v42.19,70.62 | 40.3,69.38 3.75,69.38 3.12,68.75 PAD89.1
B2  (via drill 0.6)
  Top 0.305: 40.62,94.69 40,94.69 39.69,95 35.94,95 35.62,94.69 35,94.69 34.69,94.38 34.06,94.38 33.44,93.75 33.12,93.75 30.94,91.56 30.94,91.25 30.59,90.9 S1.SIG2
  Top 0.406: 40.62,94.69 v41.56,94.38
  Top 0.61: 30.59,90.28 S1.SIG2 | v54.38,96.56 54.38,90.62 54.06,90.31 54.06,89.69 53.75,89.38 53.75,85.62 54.06,85.31 54.06,84.69 54.69,84.06 54.69,73.75 | v52.5,68.44 54.69,70.62 54.69,73.75 | 54.69,73.75 44.69,73.75 v42.81,71.88
  Bottom 0.305: IC1.9 51.6,68.06
  Bottom 0.61: PAD17.1 96.38,93.62 93.44,96.56 v54.38,96.56 48.12,96.56 45.94,94.38 v41.56,94.38 | 51.6,68.06 51.98,68.44 v52.5,68.44 | PAD13.1 40.31,70.62 41.56,71.88 v42.81,71.88
B3  (via drill 0.6)
  Top 0.61: S1.SIG4 55.59,90.28 55,89.69 55,89.06 54.69,88.75 54.69,86.25 55,85.94 55,85 55.62,84.38 55.62,83.75 56.25,83.12 56.25,82.81 57.5,81.56 57.81,81.56 58.12,81.25 v58.12,80.62 v58.12,71.88
  Bottom 0.305: IC1.10 52.2,67.53 52.93,67.53 54.46,69.06 56.88,69.06 58.12,70.31 v58.12,71.88
  Bottom 0.61: PAD15.1 94.38,79.38 93.75,80 58.75,80 v58.12,80.62
B4  (via drill 0.6)
  Top 0.61: v80.31,70.94 v80.31,81.88 80.31,85 80,85.31 80,90.31 80.2,90.51 S1.SIG6
  Bottom 0.305: IC1.11 52.8,67 53.2,67 54.6,68.4 57.3,68.4 59.84,70.94
  Bottom 0.61: 59.84,70.94 v80.31,70.94 96.56,70.94 96.88,70.62 PAD30.1 | v80.31,81.88 87.5,81.88 88.12,81.25 PAD16.1
B5
  Bottom 0.406: R4.1 43.12,64.38 44.16,64.38 IC1.1
  Bottom 0.61: S1.SIG8 5.59,65.59 8.12,68.12 10.62,68.12 | 10.62,68.12 40,68.12 43.12,65 43.12,64.38 | 10.62,68.12 10.62,65.62 11.88,64.38 14.38,64.38 14.69,64.69 | PAD103.1 15,65 14.69,64.69 | 14.69,64.69 R2.2
B6
  Bottom 0.406: IC1.32 44.48,60.94 43.49,60.94
  Bottom 0.61: S1.SIG10 36.99,65.51 37.5,65 37.5,63.75 40.62,60.62 | 43.49,60.94 40.94,60.94 40.62,60.62 | 39.38,59.38 38.12,58.12 35.62,58.12 34.06,59.69 31.56,59.69 30.31,60.94 28.44,60.94 27.5,61.88 27.5,63.44 25.94,65 22.5,65 | 39.38,59.38 40.62,60.62 | R3.1 38.1,60.65 39.38,59.38 | PAD102.1 22.5,65 | 22.5,65 22.5,62.81 R1.2
B7
  Bottom 0.406: IC1.15 55.59,65.26 S1.SIG12
B8  (via drill 0.6)
  Top 0.508: v81.25,69.69 81.25,67.14 arc-45 81.06,66.69 80.62,66.25 80.62,65.6 arc-45 S1.SIG14
  Bottom 0.305: IC1.12 53.4,66.47 53.47,66.47 54.8,67.8 57.81,67.8 59.7,69.69
  Bottom 0.508: 59.7,69.69 v81.25,69.69
  Bottom 0.61: PAD29.1 96.88,68.75 95.94,69.69 v81.25,69.69
B9  (via drill 0.6)
  Top 0.61: S1.SIG16 5.59,51.21 6.25,51.88 v6.25,56.25
  Bottom 0.406: IC1.26 47.5,57.17 47.5,55
  Bottom 0.61: PAD31.1 5.08,40 S1.SIG16 | 47.5,55 46.56,54.06 33.12,54.06 32.19,55 13.12,55 11.88,56.25 v6.25,56.25 PAD11.1
B10  (via drill 0.6)
  Top 0.5: S1.SIG18 30.59,41.21 31.25,41.88 31.25,42.19 33.12,44.06 33.75,44.06 34.06,44.38 34.38,44.38 35,45 40,45 40.62,44.38 41.25,44.38 41.88,43.75 42.19,43.75 43.75,42.19 43.75,41.88 44.06,41.56 44.69,41.56
  Top 0.61: 44.69,41.56 53.12,50 v53.12,52.5
  Bottom 0.406: IC1.24 51.56,56.98 51.56,54.38 53.12,52.81 v53.12,52.5
  Bottom 0.61: PAD32.1 29.23,41.88 S1.SIG18 | v53.12,52.5 54.06,51.56 67.19,51.56 68.75,53.12 75.62,53.12 76.25,53.75 90,53.75 90.62,54.38 PAD23.1
B11  (via drill 0.6)
  Top 0.5: 55.85,40.83 55.85,41.48 58.75,44.38 59.38,44.38 60,45 60.94,45 61.25,45.31 63.75,45.31 64.06,45 64.69,45 65.31,44.38 66.25,44.38 66.88,43.75 67.19,43.75 68.75,42.19 68.75,41.56 69.06,41.25 69.38,41.25
  Top 0.61: 55.85,40.83 S1.SIG20 | v74.38,55.94 74.38,43.75 71.88,41.25 69.38,41.25
  Bottom 0.406: 56.25,60.62 55.84,60.62 IC1.17
  Bottom 0.5: v74.38,55.94 89.06,55.94 91.25,58.12 PAD25.1
  Bottom 0.508: IC1.17 55.52,60.94
  Bottom 0.61: S1.SIG20 52.98,43.12 3.12,43.12 2.5,43.75 PAD33.1 | 56.25,60.62 57.81,60.62 61.25,57.19 70.62,57.19 71.88,55.94 v74.38,55.94
B12  (via drill 0.6)
  Top 0.508: 79,41.2 79.69,40.51 S1.SIG22
  Top 0.61: v79,68.61 79,41.2
  Bottom 0.305: IC1.13 54,65.93 54,66.2 55,67.2 58.21,67.2 59.62,68.61
  Bottom 0.5: v79,68.61 95.14,68.61 96.88,66.88 PAD28.1
  Bottom 0.508: 59.62,68.61 v79,68.61
  Bottom 0.61: S1.SIG22 76.73,44.38 3.75,44.38 2.5,45.62 PAD34.1
B13  (via drill 0.6)
  Top 0.406: 4.38,36.25 4.38,35.62 4.69,35.31 4.69,34.38 5.31,33.75 5.31,33.44 6.25,32.5 6.25,31.88 8.12,30
  Top 0.61: S1.SIG24 5.62,15.55 5.62,16.88 8.12,19.38 8.12,30 | 4.38,36.25 4.38,36.88 4.06,37.19 4.06,41.25 4.69,41.88 4.69,52.19 5,52.5 v5,54.38
  Bottom 0.406: IC1.25 48.44,56.98
  Bottom 0.61: PAD38.1 10,10 10.62,10.62 10.62,15 10,15.62 5.7,15.62 S1.SIG24 | PAD12.1 v5,54.38 5.31,54.06 31.56,54.06 32.5,53.12 47.19,53.12 48.44,54.38 48.44,56.98
B14  (via drill 0.6)
  Top 0.5: S1.SIG26 30.59,16.21 31.25,16.88 31.25,17.19 32.19,18.12 32.5,18.12 33.44,19.06 33.75,19.06 34.38,19.69 35,19.69 35.31,20 39.69,20 40,19.69 40.94,19.69 44.38,16.25 44.38,15.62 44.69,15.31 45.94,15.31
  Top 0.508: 30.38,15.51 S1.SIG26
  Top 0.61: 45.94,15.31 45.94,41.56 55.14,50.76 v55.14,52.81
  Bottom 0.406: 52.32,57.35 52.32,54.86 54.38,52.81 v55.14,52.81
  Bottom 0.508: IC1.23 52.32,57.35
  Bottom 0.61: S1.SIG26 30.7,15.62 35,15.62 35.62,15 35.62,8.75 35,8.12 PAD37.1 | PAD24.1 90.62,56.25 89.38,55 75.62,55 75,54.38 68.12,54.38 66.56,52.81 v55.14,52.81
B15  (via drill 0.6)
  Top 0.5: S1.SIG28 55.59,16.21 58.75,19.38 59.38,19.38 60,20 65,20 65.62,19.38 66.25,19.38 68.75,16.88 | 68.75,31.25 70.62,33.12
  Top 0.61: 68.75,16.88 68.75,31.25 | v75.62,57.19 75.62,43.12 70.62,38.12 70.62,33.12
  Bottom 0.5: PAD26.1 91.88,60 89.06,57.19 v75.62,57.19
  Bottom 0.508: IC1.16 56.06,64.6 58.75,64.6
  Bottom 0.61: S1.SIG28 55.7,15.62 60,15.62 60.62,15 60.62,6.88 60,6.25 PAD36.1 | 58.75,64.6 60.62,62.73 60.62,59.38 61.88,58.12 71.25,58.12 72.19,57.19 v75.62,57.19
B16  (via drill 0.6)
  Top 0.61: v77.6,67.61 77.6,18.5 S1.SIG30
  Bottom 0.305: IC1.14 54.6,65.4 54.6,66 55.2,66.6 58.62,66.6 58.66,66.56 59.71,67.61
  Bottom 0.5: v77.6,67.61 94.26,67.61 96.88,65 PAD27.1
  Bottom 0.508: 59.71,67.61 v77.6,67.61
  Bottom 0.61: S1.SIG30 80.7,15.62 85,15.62 85.62,15 85.62,5.62 85,5 4.38,5 3.75,4.38 PAD35.1
D_OUT  (via drill 0.6)
  Top 0.61: v90.94,12.19 90.94,13.75 90.62,14.06 89.94,14.06 LED16.2-DOUT
  Bottom 0.61: PAD6.1 91.25,12.5 v90.94,12.19
DATA  (via drill 0.6)
  Top 0.61: LED1.4-DIN 10.06,85.94 9.69,85.94 9.38,86.25 v9.38,87.19 | v50,56.56 50,61.88 59.38,71.25 v59.38,77.5 | v4.06,87.5 4.06,79.38 4.69,78.75 v4.69,76.88 | v3.12,51.88 PAD100.1
  Top 1.27: PAD101.1 95.62,76.88 v95,76.25
  Bottom 0.406: IC1.31 46.23,61.56 46.88,61.56 50,58.44 v50,56.56
  Bottom 0.61: v9.38,87.19 7.19,87.19 6.88,87.5 v4.06,87.5 PAD7.1 | v4.69,76.88 10.62,76.88 11.25,77.5 v59.38,77.5 91.88,77.5 93.12,76.25 v95,76.25 | v50,56.56 50,54.69 47.81,52.19 3.44,52.19 v3.12,51.88
DO1  (via drill 0.6)
  Top 0.61: LED2.4-DIN 35.06,85.94 34.69,85.94 34.38,86.25 v34.38,87.19 | v15.94,87.19 15.94,88.75 15.54,89.15 LED1.2-DOUT
  Bottom 0.61: v34.38,87.19 28.12,87.19 26.25,85.31 23.75,85.31 21.88,87.19 v15.94,87.19
DO2  (via drill 0.6)
  Top 0.61: LED2.2-DOUT 40.54,89.15 40.94,88.75 v40.94,87.19 | v59.38,87.19 59.38,86.25 59.69,85.94 60.06,85.94 LED3.4-DIN
  Bottom 0.61: v40.94,87.19 v59.38,87.19
DO3  (via drill 0.6)
  Top 0.61: LED3.2-DOUT 65.54,89.15 65.94,88.75 v65.94,87.19 | v84.38,87.19 84.38,86.25 84.69,85.94 85.06,85.94 LED4.4-DIN
  Bottom 0.61: v65.94,87.19 71.88,87.19 73.75,85.31 76.25,85.31 78.12,87.19 v84.38,87.19
DO4  (via drill 0.6)
  Top 0.61: LED4.2-DOUT 90.54,89.15 90.94,88.75 v90.94,87.19 | v9.38,62.19 9.38,61.25 9.69,60.94 10.06,60.94 LED5.4-DIN | v96.56,87.5 96.56,84.69 93.75,81.88 v93.75,78.12 | v1.56,62.5 1.56,66.25 6.25,70.94 v6.25,78.75
  Bottom 0.61: PAD3.1 98.12,87.5 91.25,87.5 v90.94,87.19 | v9.38,62.19 7.31,62.19 7,62.5 1.88,62.5 | v1.56,62.5 PAD8.1 | v6.25,78.75 93.12,78.75 v93.75,78.12
  Bottom 1.016: v96.56,87.5 98.12,87.5 | v1.56,62.5 1.88,62.5
DO6  (via drill 0.6)
  Top 0.61: LED6.2-DOUT 40.54,64.15 40.94,63.75 v40.94,62.19 | v59.38,62.19 59.38,61.25 59.69,60.94 60.06,60.94 LED7.4-DIN
  Bottom 0.406: 44.69,62.5 45.94,62.5 | 54.06,62.5 55.31,62.5
  Bottom 0.61: v40.94,62.19 44.38,62.19 44.69,62.5 | 45.94,62.5 54.06,62.5 | 55.31,62.5 55.62,62.19 v59.38,62.19
DO7  (via drill 0.6)
  Top 0.61: LED7.2-DOUT 65.54,64.15 65.94,63.75 v65.94,62.19 | v84.38,62.19 84.38,61.25 84.69,60.94 85.06,60.94 LED8.4-DIN
  Bottom 0.61: v65.94,62.19 71.88,62.19 73.75,60.31 76.25,60.31 78.12,62.19 v84.38,62.19
DO8  (via drill 0.6)
  Top 0.61: LED8.2-DOUT 90.54,64.15 90.94,63.75 v90.94,62.19 | v9.38,37.19 9.38,36.25 9.69,35.94 10.06,35.94 LED9.4-DIN | v92.19,46.25 92.19,55.31 96.56,59.69 v96.56,62.5 | PAD9.1 1.25,40.31 3.44,42.5 v3.44,46.25
  Bottom 0.5: PAD4.1 91.25,62.5 v90.94,62.19
  Bottom 0.61: v9.38,37.19 7.31,37.19 7,37.5 PAD9.1 | v96.56,62.5 PAD4.1
  Bottom 1.016: v92.19,46.25 v3.44,46.25
  other vias: 1.25,37.5
DO9  (via drill 0.6)
  Top 0.61: LED9.2-DOUT 15.54,39.15 15.94,38.75 v15.94,37.19 | v34.38,37.19 34.38,36.25 34.69,35.94 35.06,35.94 LED10.4-DIN
  Bottom 0.61: v15.94,37.19 17.81,35.31 32.5,35.31 v34.38,37.19
DO10  (via drill 0.6)
  Top 0.61: LED10.2-DOUT 40.54,39.15 40.94,38.75 v40.94,37.19 | v59.38,37.19 59.38,36.25 59.69,35.94 60.06,35.94 LED11.4-DIN
  Bottom 0.61: v40.94,37.19 42.81,35.31 57.5,35.31 v59.38,37.19
DO11  (via drill 0.6)
  Top 0.61: LED11.2-DOUT 65.54,39.15 65.94,38.75 v65.94,37.19 | v84.38,37.19 84.38,36.25 84.69,35.94 85.06,35.94 LED12.4-DIN
  Bottom 0.61: v65.94,37.19 67.81,35.31 82.5,35.31 v84.38,37.19
DO12  (via drill 0.6)
  Top 0.61: LED12.2-DOUT 90.54,39.15 90.94,38.75 v90.94,37.19 | v9.38,12.19 9.38,11.25 9.69,10.94 10.06,10.94 LED13.4-DIN | v3.75,12.5 3.75,13.12 4.38,13.75 4.38,16.88 7.19,19.69 7.19,26.56 v6.88,26.88
  Top 1.016: v96.25,27.5 v96.25,37.5
  Bottom 0.61: PAD5.1 98.12,37.5 91.25,37.5 v90.94,37.19 | v9.38,12.19 7.31,12.19 7,12.5 1.88,12.5 PAD10.1 | 95.31,27.19 7.19,27.19 v6.88,26.88
  Bottom 1.016: 95.31,27.19 96.25,27.19 v96.25,27.5 | v96.25,37.5 98.12,37.5 | v3.75,12.5 1.88,12.5
DO13  (via drill 0.6)
  Top 0.61: LED13.2-DOUT 15.54,14.15 15.94,13.75 v15.94,12.19 | v34.38,12.19 34.38,11.25 34.69,10.94 35.06,10.94 LED14.4-DIN
  Bottom 0.61: v15.94,12.19 22.19,12.19 24.06,10.31 25.94,10.31 27.81,12.19 v34.38,12.19
DO14  (via drill 0.6)
  Top 0.61: LED14.2-DOUT 40.54,14.15 40.94,13.75 v40.94,12.19 | v59.38,12.19 59.38,11.25 59.69,10.94 60.06,10.94 LED15.4-DIN
  Bottom 0.61: v40.94,12.19 v59.38,12.19
DO15  (via drill 0.6)
  Top 0.61: LED15.2-DOUT 65.54,14.15 65.94,13.75 v65.94,12.19 | v84.38,12.19 84.38,11.25 84.69,10.94 85.06,10.94 LED16.4-DIN
  Bottom 0.61: v65.94,12.19 72.19,12.19 74.06,10.31 75.94,10.31 77.81,12.19 v84.38,12.19
FO5  (via drill 0.6)
  Top 0.61: v34.38,62.19 34.38,61.25 34.69,60.94 35.06,60.94 LED6.4-DIN | LED5.2-DOUT 13.97,64.15 v12.5,65.62
  Bottom 0.61: v12.5,65.62 13.75,66.88 25.62,66.88 29.38,63.12 31.56,63.12 32.5,62.19 v34.38,62.19
GND  (via drill 0.6)
  Top 0.61: LED2.3-GND 33.8,89.15 S1.SIG3 | LED3.3-GND 58.8,89.15 S1.SIG5 | LED4.3-GND 83.8,89.15 S1.SIG7 | S1.SIG15 83.8,64.15 LED8.3-GND | S1.SIG13 58.8,64.15 LED7.3-GND | LED6.3-GND 33.8,64.15 | LED5.3-GND 8.8,64.15 | LED9.3-GND 8.8,39.15 S1.SIG17 | LED10.3-GND 33.8,39.15 S1.SIG19 | LED11.3-GND 58.8,39.15 S1.SIG21 | LED12.3-GND 83.8,39.15 S1.SIG23 | LED16.3-GND 83.8,14.15 S1.SIG31 | LED15.3-GND 58.8,14.15 S1.SIG29 | LED14.3-GND 33.8,14.15 S1.SIG27 | LED1.3-GND 8.8,89.15 S1.SIG1 | LED13.3-GND 8.8,14.15 S1.SIG25
  Top 0.813: LED7.3-GND 61.65,64.15 62.5,65 v62.5,65.62 | S1.SIG9 8.8,64.15 | 33.8,64.15 S1.SIG11
  Top 1.27: v26.25,96.88 v26.25,91.25 27.19,90.94 v27.19,71.88 v27.19,48.75 v27.19,40.31 v27.19,17.5 v27.19,13.75 27.19,11.25 26.25,10.31 v26.25,2.19 | v71.25,73.75 v71.25,65.62 71.25,55.94 v68.12,55.94 | v9.38,71.88 v4.38,66.88 3.44,65.94 v3.44,60
  Bottom 0.406: 44.48,66.32 IC1.3 47.05,63.75 | IC1.5 48.07,65 48.12,65 48.12,64.38 | IC1.21 53.9,58.03
  Bottom 0.508: 44.48,66.32 C2.2 | 47.05,63.75 47.5,63.75 48.12,64.38 | 53.9,58.03 53.9,57.39 54.82,56.46 C1.2
  Bottom 0.61: C1.2 55.1,56.46 | 99.38,85 PAD53.1 | S1.SIG7 83.13,92.18 83.12,92.5 | 58.13,92.5 58.44,92.5 | PAD61.1 v26.25,2.19 | 96.25,17.5 96.88,16.88 PAD75.1 | 45.62,73.75 C4.1 | C2.2 42.81,68.55 42.81,69.69 44.06,70.94 44.06,73.75 | 4.38,65 5.89,63.48 S1.SIG9 8.13,65.31 PAD105.1 | S1.SIG11 32.55,64.06 32.5,64.06 | 30,71.88 30.31,71.88
  Bottom 0.813: 55.1,56.46 55.1,56.15 57.1,54.15 PAD95.1 | 4.38,65 v4.38,66.88 | PAD95.1 57.68,54.06 | v68.12,55.94 66.34,54.15 PAD95.1 | v27.19,66.88 30,64.06 32.5,64.06
  Bottom 1.016: S1.SIG29 53.12,13.48 53.12,17.5 | v27.19,13.75 33.13,13.75 S1.SIG27 | S1.SIG25 7.55,14.06 4.69,14.06 4.06,14.69 4.06,15.94 3.12,16.88
  Bottom 1.27: 50.31,73.75 45.62,73.75 44.06,73.75 41.25,73.75 39.39,71.89 35,71.88 33.75,71.88 | 50.31,73.75 C3.1 | PAD53.1 v98.12,85 89.38,85 89.38,91.56 88.44,92.5 83.12,92.5 v75,92.5 58.44,92.5 v50.62,92.5 50,92.5 47.81,90.31 39.69,90.31 38.75,91.25 35.9,91.25 S1.SIG3 32.86,88.75 28.75,88.75 v26.25,91.25 18.12,91.25 17.5,90.62 12.5,90.62 11.25,89.38 | PAD58.1 v1.88,85 10,85 11.25,86.25 11.25,89.38 | S1.SIG5 58.13,92.5 | PAD65.1 v26.25,96.88 | PAD45.1 3.12,16.88 3.75,17.5 v27.19,17.5 v50,17.5 53.12,17.5 v75,17.5 78.12,17.5 | 78.12,17.5 96.25,17.5 | S1.SIG17 8.13,39.69 8.75,40.31 v27.19,40.31 29.02,38.48 S1.SIG19 34.96,40.31 v50,40.31 53.44,40.31 55.27,38.48 S1.SIG21 59.96,40.31 78.44,40.31 80.27,38.48 S1.SIG23 86.52,41.88 v96.25,41.88 PAD44.1 | 50.31,73.75 59.38,73.75 60.62,72.5 63.75,72.5 65,73.75 v71.25,73.75 v77.5,73.75 84.69,73.75 85.94,72.5 89.06,72.5 90.31,73.75 98.75,73.75 PAD93.1 | IC2.1 34.14,72.11 33.75,71.88 | v62.5,65.62 v71.25,65.62 77.5,65.62 79.64,63.48 S1.SIG15 | PAD87.1 v3.44,60 | v9.38,71.88 v15.62,71.88 v27.19,71.88 30,71.88 | 30.31,71.88 33.75,71.88 | S1.SIG1 8.13,88.75 8.75,89.38 11.25,89.38 | S1.SIG31 78.12,13.48 78.12,17.5 | v27.19,48.75 1.25,48.75 PAD50.1
  pour Top (isolate 0.813): 29.38,100 29.38,54.38 0,54.38 0,100
  pour Top (isolate 0.813): 0,50 0,54.38 25.62,54.38 25.62,52.5 46.88,52.5 46.88,53.12 58.12,53.12 58.12,50
  pour Top (isolate 0.813): 0,0 100,0 100,50 0,50
  pour Top (isolate 0.813): 73.12,75 100,75 100,50 73.12,50
  pour Top (isolate 0.813): 29.38,100 100,100 100,75 29.38,75
  pour Top (isolate 0.813): 28.75,55.62 71.25,55.62 71.25,75 29.38,75
INT  (via drill 0.6)
  Top 0.406: 20.62,48.75 19.69,49.69 PAD92.1
  Top 0.5: 20.62,95.62 19.38,96.88 PAD67.1
  Top 0.61: v19.38,2.19 19.38,7.81 20.62,9.06 20.62,19.38 20,20 20,21.25 20.62,21.88 20.62,48.75 | 20.62,95.62 v20.62,60.31 20.62,59.38 20.31,59.06 20.31,53.44 19.69,52.81 PAD92.1
  Top 1.016: PAD67.1 v30,98.75 | v30,0.62 v18.12,0.62
  Bottom 0.406: 44.69,59.69 45.49,59.69 IC1.30
  Bottom 0.61: v19.38,2.19 PAD68.1 v18.12,0.62 | 44.69,59.69 41.25,59.69 38.75,57.19 35,57.19 33.44,58.75 31.25,58.75 30,60 27.81,60 27.5,60.31 v20.62,60.31
  Bottom 1.016: PAD72.1 v18.12,0.62 | PAD71.1 v30,0.62
  Bottom 1.27: PAD67.1 19.38,99.38 PAD70.1 | v30,98.75 30,99.38 PAD69.1
  other vias: 19.38,98.75
N$2
  Bottom 0.61: R3.2 35.62,63.07 PAD97.1
N$3
  Bottom 0.61: PAD19.1 3.12,29.38 4.06,28.44 95.31,28.44 96.25,29.38 PAD39.1
N$4
  Bottom 0.61: PAD20.1 3.12,31.25 4.69,29.69 94.69,29.69 96.25,31.25 PAD40.1
N$5
  Bottom 0.61: PAD21.1 3.12,33.12 5.31,30.94 94.06,30.94 96.25,33.12 PAD41.1
N$6
  Bottom 0.61: PAD22.1 3.12,35 5.94,32.19 93.44,32.19 96.25,35 PAD42.1
N$7  (via drill 0.6)
  other vias: 87.5,72.5
N$17
  Bottom 0.61: R4.2 38.75,64.38 38.44,64.69 38.44,65.62 PAD98.1
RESET
  Bottom 0.406: IC1.29 44.53,57.59 PAD88.1
SCL  (via drill 0.6)
  Top 0.61: v23.75,96.88 v23.75,93.12 22.5,91.88 22.5,60 v23.44,59.06 PAD91.1 23.44,49.38 22.81,48.75 v22.81,19.38 22.81,9.06 23.75,8.12 v23.75,2.19
  Bottom 0.406: IC1.28 45.93,57.86 45.93,56.55 45.32,55.94 45.31,55.94
  Bottom 0.61: PAD51.1 96.25,90 92.19,94.06 48.75,94.06 46.56,91.88 40.62,91.88 39.38,93.12 v23.75,93.12 16.88,93.12 16.25,92.5 5.31,92.5 2.81,90 PAD56.1 0.62,90 | PAD64.1 v23.75,96.88 | PAD60.1 v23.75,2.19 | PAD73.1 3.12,18.75 3.75,19.38 v22.81,19.38 96.25,19.38 96.88,18.75 PAD82.1 | 45.31,55.94 34.69,55.94 32.81,57.81 30.62,57.81 29.38,59.06 v23.44,59.06 16.88,59.06 16.56,59.38 16.56,62.5 16.88,62.81 R1.1
SDA  (via drill 0.6)
  Top 0.61: v21.88,96.88 v21.88,94.38 21.56,94.06 v21.56,57.81 PAD90.1 v21.56,20.62 21.56,2.5 v21.88,2.19
  Bottom 0.406: IC1.27 46.72,57.52 46.72,55.55 46.18,55.02 45.64,55.02 45.62,55
  Bottom 0.5: PAD63.1 v21.88,96.88
  Bottom 0.61: PAD52.1 96.25,91.88 92.81,95.31 48.44,95.31 46.25,93.12 41.25,93.12 40,94.38 v21.88,94.38 16.88,94.38 16.25,93.75 5,93.75 3.12,91.88 PAD55.1 | PAD59.1 v21.88,2.19 | PAD74.1 v21.56,20.62 PAD81.1 | 45.62,55 33.75,55 31.88,56.88 30,56.88 29.06,57.81 v21.56,57.81 14.69,57.81 R2.1
VCC  (via drill 0.6)
  Top 0.61: LED9.1-VDD 13.35,35.85 12.5,35 v12.5,34.38 | v37.5,34.38 37.5,35 38.44,35.94 39.76,35.94 LED10.1-VDD | LED11.1-VDD 63.35,35.85 62.5,35 v62.5,34.38 | LED12.1-VDD 88.35,35.85 87.5,35 v87.5,34.38 | LED7.1-VDD 63.35,60.85 62.5,60 v62.5,59.38 | LED8.1-VDD 88.35,60.85 87.5,60 v87.5,59.38 | v44.06,69.38 41.88,69.38 40,71.25 | LED6.1-VDD 38.38,59.38 v36.25,59.38
  Top 1.27: 28.75,53.12 v28.75,33.75 v28.75,22.5 v28.75,15.62 28.75,10 28.12,9.38 v28.12,2.19 28.44,2.5 50,2.5 | v28.12,96.88 28.12,93.12 28.75,92.5 v28.75,84.06 v28.75,73.44 v28.75,62.19 v28.75,56.25 28.75,53.12 | v2.5,15 2.5,17.5 5.62,20.62 v5.62,22.5 | 95.62,15.62 v96.25,15 96.88,14.38 96.88,5 94.38,2.5 72.5,2.5 | LED13.1-VDD 12.72,10.85 12.5,10.62 v12.5,9.38 | LED14.1-VDD 37.73,10.85 37.5,10.62 v37.5,9.38 | LED15.1-VDD 62.73,10.85 62.5,10.62 v62.5,9.38 | LED16.1-VDD 87.72,10.85 87.5,10.62 v87.5,9.38 | v72.81,84.06 v72.81,58.75 72.81,53.12 | LED3.1-VDD 63.35,85.85 62.5,85 v62.5,84.38 | 40,71.25 31.88,71.25 v31.88,73.44 | v44.06,69.38 44.06,68.44 46.88,65.62 46.88,55.62 47.5,55 50.62,55 51.88,56.25 56.88,56.25 v57.5,55.62 | v12.5,59.38 12.5,60 13.12,60.62 14.62,60.62 LED5.1-VDD | v3.12,36.25 v3.12,26.88 | LED1.1-VDD 13.35,85.85 12.5,85 v12.5,84.38 | LED2.1-VDD 38.35,85.85 37.5,85 v37.5,84.38 | LED4.1-VDD 88.35,85.85 87.5,85 v87.5,84.38 | 72.5,2.5 50,2.5 | v72.5,9.38 72.5,2.5 | v50,9.38 50,2.5 | 72.81,53.12 57.19,53.12 55.94,54.38 52.81,54.38 51.56,53.12 28.75,53.12 | v72.81,51.88 72.81,53.12
  Bottom 0.406: IC1.6 47,67.19 | IC1.4 46.1,65.83 | 54.41,58.66 IC1.20 53.32,59.81 52.5,60.62 52.5,60.88 53.34,61.72 53.61,61.72 IC1.18
  Bottom 0.508: C2.1 46.28,67.91 47,67.19 46.1,66.29 46.1,65.83 | 54.41,58.66 55.42,58.66 56.27,57.81 C1.1
  Bottom 0.61: C1.1 56.3,57.77 56.61,57.77 57.5,56.88 v57.5,55.62 58.44,55.62 58.75,55.94 62.19,55.94 PAD96.1 | v44.06,69.38 44.68,69.38 C2.1 | IC2.3 29.67,73.78 | 29.67,73.78 29.69,73.6 31.73,73.6 IC2.2 | v28.12,2.19 PAD62.1 | PAD46.1 v2.5,15 | v28.75,73.44 28.77,73.72 29.62,73.72 29.67,73.78 | v36.25,59.38 34.69,60.94 32.19,60.94 30.94,62.19 v28.75,62.19 | PAD104.1 12.5,62.19 v12.5,59.38
  Bottom 1.27: PAD66.1 v28.12,96.88 | PAD76.1 v96.25,15 95.62,15.62 88.12,15.62 87.5,15 v87.5,9.38 | v5.62,22.5 v28.75,22.5 | v12.5,9.38 12.5,15 13.12,15.62 v28.75,15.62 | PAD54.1 88.75,83.12 v87.5,84.38 arc-90 87.19,84.06 v72.81,84.06 62.81,84.06 arc-90 v62.5,84.38 62.5,84.06 37.5,84.06 | v31.88,73.44 31.85,73.46 IC2.2 | PAD49.1 91.25,40 87.5,36.25 v87.5,34.38 87.5,33.75 62.5,33.75 | v3.12,36.25 4.38,36.25 6.88,33.75 12.5,33.75 | PAD57.1 11.25,83.12 v12.5,84.38 12.81,84.06 v28.75,84.06 37.5,84.06 | v62.5,9.38 v72.5,9.38 | v37.5,9.38 v50,9.38 | v62.5,34.38 62.5,33.75 | v37.5,34.38 37.5,33.75 | 37.5,33.75 62.5,33.75 | 37.5,33.75 v28.75,33.75 12.5,33.75 | 12.5,33.75 v12.5,34.38 | v37.5,84.38 37.5,84.06 | v87.5,59.38 87.5,58.75 v72.81,58.75 72.81,59.06 71.25,60.62 63.75,60.62 v62.5,59.38 | PAD94.1 v72.81,51.88 | v3.12,26.88 3.12,25.62 1.25,25.62 PAD48.1 | v28.75,56.25 14.06,56.25 12.5,57.81 12.5,58.12 | 12.5,58.12 v12.5,59.38 | PAD83.1 12.5,58.12
  pour Bottom (isolate 0.813): 0,0 100,0 100,100 0,100
XTAL1
  Bottom 0.406: IC1.7 47.75,67.58 47.75,68.2 47.9,68.35
  Bottom 0.61: 47.9,68.35 47.9,69.69 | 47.9,69.69 X1.2 | 47.9,69.69 45.94,69.69 45.62,70 C4.2
XTAL2
  Bottom 0.406: 48.75,67.71 48.75,68.12
  Bottom 0.508: IC1.8 48.75,67.71
  Bottom 0.61: 48.75,68.12 50.31,69.69 | 50.31,69.69 C3.2 | X1.1 52.81,71.47 52.81,70.31 52.19,69.69 50.31,69.69

### Text on the board
tPlace: 16 LED+BUTTON PAD | INT | SDA | SCL | GND | VCC | v1.0
bPlace: INT | INT | INT | GND | VCC | SDA | SCL | SDA | SCL | SDA | SCL | GND | GND | VCC | AMS1117-3.3 | ONLY FOR USB DEVICE | GND | CUT | GND | MOSI | I | VCC | I | GND | VCC | ADC6 | VCC | RESET | ADC7 | GND | VCC | GND | SCK | GND | VCC | VCC | SDA | SDA | SCL | SCL | GND | MISO | GND | VCC | VCC | DOUT | INT | SDA | SCL | GND | VCC | INT | INT
tDocu: INT | SDA | SCL | GND | VCC | INT | INT | B1 | B2 | SDA | SDA | SCL | SCL | DATA | DATA | GND | GND | VCC | VCC | B4 | B3 | GND | B1 | B12 | B2 | B11 | SDA | B10 | B10 | SCL | B9 | DATA | DATA | GND | B13 | B13 | VCC | B14 | B4 | B15 | B3 | B16 | B16 | VCC | GND | B12 | B11 | B10 | GND | B9 | VCC | DATA | DATA | B13 | B13 | B14 | B14 | B15 | B15 | B16 | B16 | B16 | VCC | SDA | SDA | SCL | SCL | GND | GND | VCC | VCC | DATA | DATA | B13 | B14 | B15 | B16 | INT | INT